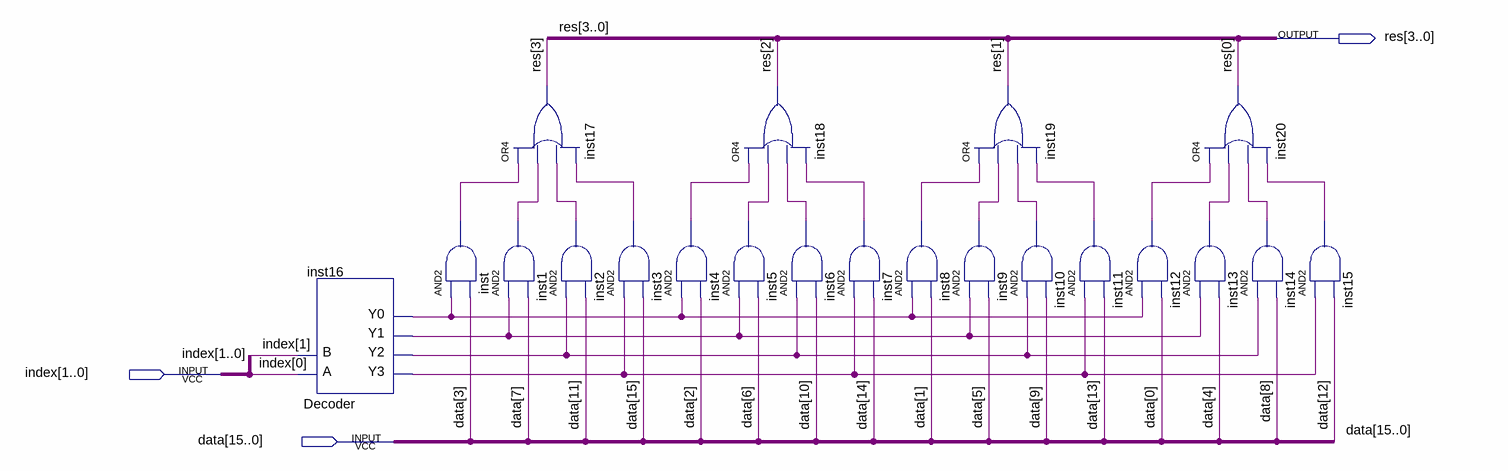
[diagram p0: schematic sheet]
// Quartus schematic Parser.bdf as structural Verilog: 21 symbols, 3 pins
module Parser (
  input  [1:0] index,
  input  [15:0] data,
  output [3:0] res
);

  wire inst1_out, inst2_out, inst3_out, inst4_out, inst5_out, inst6_out, inst7_out, inst8_out, inst9_out,
       inst10_out, inst11_out, inst12_out, inst13_out, inst14_out, inst15_out, inst16_y0, inst16_y1,
       inst16_y2, inst16_y3, inst_out;

  Decoder inst16 (.A(index[0]), .B(index[1]), .Y3(inst16_y3), .Y2(inst16_y2), .Y1(inst16_y1), .Y0(inst16_y0));
  and inst (inst_out, inst16_y0, data[3]);
  or inst17 (res[3], inst_out, inst1_out, inst2_out, inst3_out);
  and inst1 (inst1_out, inst16_y1, data[7]);
  and inst2 (inst2_out, inst16_y2, data[11]);
  and inst3 (inst3_out, inst16_y3, data[15]);
  and inst4 (inst4_out, inst16_y0, data[2]);
  or inst18 (res[2], inst4_out, inst5_out, inst6_out, inst7_out);
  and inst5 (inst5_out, inst16_y1, data[6]);
  and inst6 (inst6_out, inst16_y2, data[10]);
  and inst7 (inst7_out, inst16_y3, data[14]);
  and inst8 (inst8_out, inst16_y0, data[1]);
  or inst19 (res[1], inst8_out, inst9_out, inst10_out, inst11_out);
  and inst9 (inst9_out, inst16_y1, data[5]);
  and inst10 (inst10_out, inst16_y2, data[9]);
  and inst11 (inst11_out, inst16_y3, data[13]);
  and inst12 (inst12_out, inst16_y0, data[0]);
  or inst20 (res[0], inst12_out, inst13_out, inst14_out, inst15_out);
  and inst13 (inst13_out, inst16_y1, data[4]);
  and inst14 (inst14_out, inst16_y2, data[8]);
  and inst15 (inst15_out, inst16_y3, data[12]);
endmodule
